# Altium schematic sheet STM32F103xx_LQFP48.SchDoc
size A; SheetNumber: 1; SheetTotal: 9
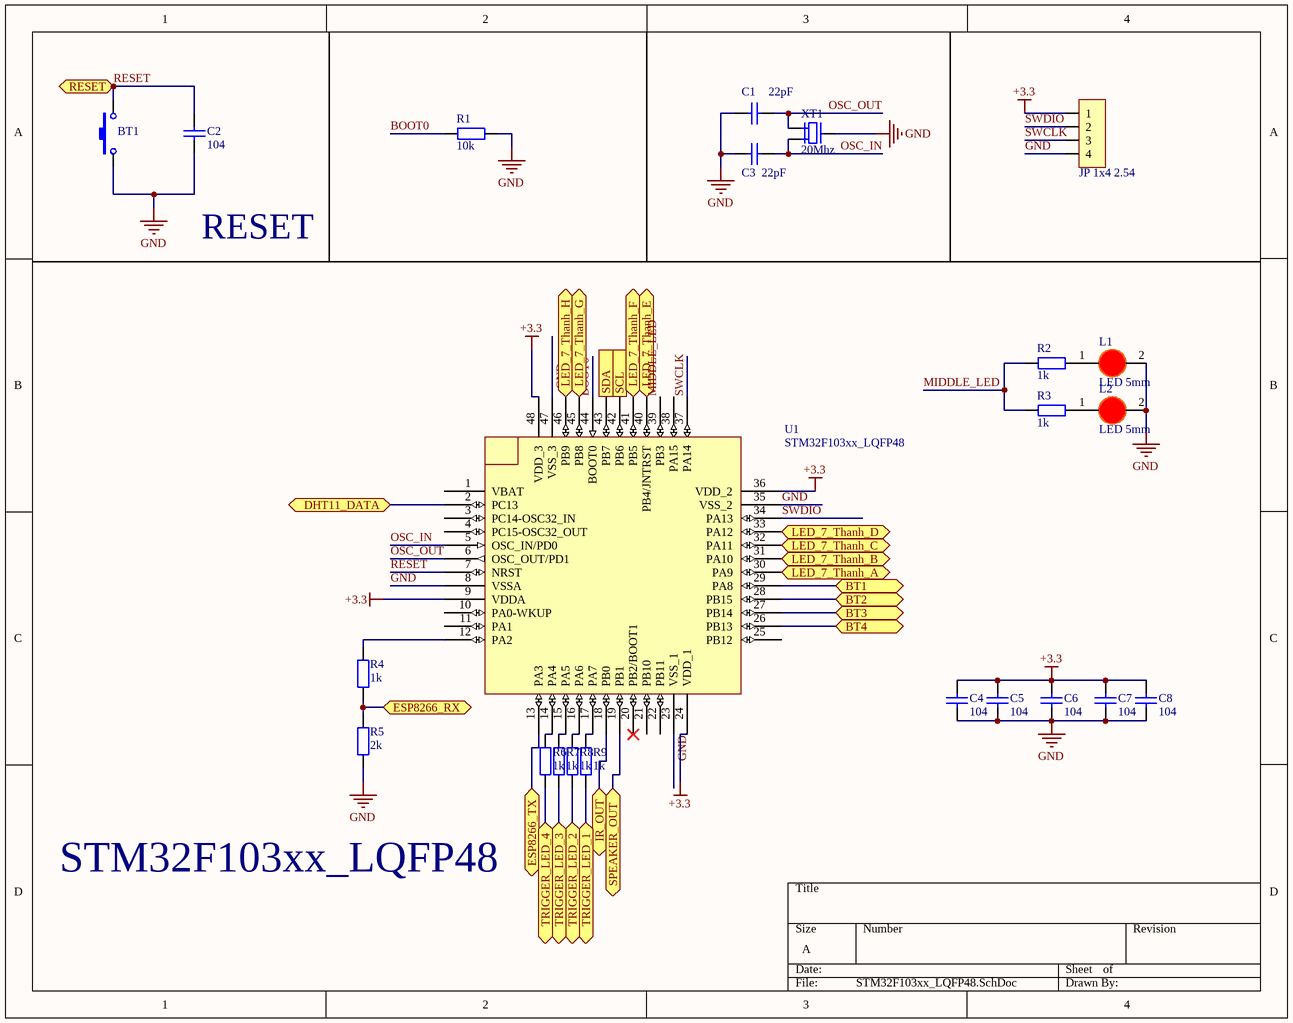
[diagram p0: STM32F103xx_LQFP48.SchDoc]

## Parts
BT1  Nut Nhan 2 Chan SMD 3x6x2.5  [Nut Nhan 2 Chan SMD 3x6x2.5]  (value not drawn)
C1  22pF  [tu 0603]
C2  104  [tu 0603]
C3  22pF  [tu 0603]
C4  104  [tu 0603]
C5  104  [tu 0603]
C6  104  [tu 0603]
C7  104  [tu 0603]
C8  104  [tu 0603]
JP1  JP 1x4 2.54  [JP 1x4 DC]
L1  LED 5mm  [LED-5MM-RED]
L2  LED 5mm  [LED-5MM-RED]
R1  10k  [tro smd 0603]
R2  1k  [tro smd 0603]
R3  1k  [tro smd 0603]
R4  1k  [tro smd 0603]
R5  2k  [tro smd 0603]
R6  1k  [tro smd 0603]
R7  1k  [tro smd 0603]
R8  1k  [tro smd 0603]
R9  1k  [tro smd 0603]
U1  STM32F103xx_LQFP48  [STM32_LQPF48]
XT1  20Mhz  [Thach Anh 3 Chan SMD]

## Ports
BT1 (bidir), BT2 (bidir), BT3 (bidir), BT4 (bidir), DHT11_DATA (bidir), ESP8266_RX (bidir), ESP8266_TX (bidir), IR_OUT (bidir), LED_7_Thanh_A (bidir), LED_7_Thanh_B (bidir), LED_7_Thanh_C (bidir), LED_7_Thanh_D (bidir), LED_7_Thanh_E (bidir), LED_7_Thanh_F (bidir), LED_7_Thanh_G (bidir), LED_7_Thanh_H (bidir), RESET (bidir), SCL, SDA, SPEAKER_OUT (bidir), TRIGGER_LED_1 (bidir), TRIGGER_LED_2 (bidir), TRIGGER_LED_3 (bidir), TRIGGER_LED_4 (bidir)

## Nets
+3.3: C4.1 C5.1 C6.1 C7.1 C8.1 JP1.1 U1.9(VDDA) U1.24(VDD_1) U1.36(VDD_2) U1.48(VDD_3)
GND: BT1.1 C1.2 C2.2 C3.2 C4.2 C5.2 C6.2 C7.2 C8.2 JP1.4 L1.2(K) L2.2(K) R1.2 R5.1 U1.8(VSSA) U1.23(VSS_1) U1.35(VSS_2) U1.47(VSS_3) XT1.2
BOOT0: R1.1 U1.44(BOOT0)
BT1: U1.29(PA8) ; port BT1
BT2: U1.28(PB15) ; port BT2
BT3: U1.27(PB14) ; port BT3
BT4: U1.26(PB13) ; port BT4
DHT11_DATA: U1.2(PC13) ; port DHT11_DATA
ESP8266_RX: R4.1 R5.2 ; port ESP8266_RX
ESP8266_TX: U1.13(PA3) ; port ESP8266_TX
IR_OUT: U1.18(PB0) ; port IR_OUT
LED_7_Thanh_A: U1.30(PA9) ; port LED_7_Thanh_A
LED_7_Thanh_B: U1.31(PA10) ; port LED_7_Thanh_B
LED_7_Thanh_C: U1.32(PA11) ; port LED_7_Thanh_C
LED_7_Thanh_D: U1.33(PA12) ; port LED_7_Thanh_D
LED_7_Thanh_E: U1.40(PB4/JNTRST) ; port LED_7_Thanh_E
LED_7_Thanh_F: U1.41(PB5) ; port LED_7_Thanh_F
LED_7_Thanh_G: U1.45(PB8) ; port LED_7_Thanh_G
LED_7_Thanh_H: U1.46(PB9) ; port LED_7_Thanh_H
MIDDLE_LED: R2.1 R3.1 U1.39(PB3)
OSC_IN: C3.1 U1.5(OSC_IN/PD0) XT1.3
OSC_OUT: C1.1 U1.6(OSC_OUT/PD1) XT1.1
RESET: BT1.2 C2.1 U1.7(NRST) ; port RESET
SCL: U1.42(PB6) ; port SCL
SDA: U1.43(PB7) ; port SDA
SPEAKER_OUT: U1.19(PB1) ; port SPEAKER_OUT
SWCLK: JP1.3 U1.37(PA14)
SWDIO: JP1.2 U1.34(PA13)
TRIGGER_LED_1: R9.2 ; port TRIGGER_LED_1
TRIGGER_LED_2: R8.2 ; port TRIGGER_LED_2
TRIGGER_LED_3: R7.2 ; port TRIGGER_LED_3
TRIGGER_LED_4: R6.2 ; port TRIGGER_LED_4
NetL1_1: L1.1(A) R2.2
NetL2_1: L2.1(A) R3.2
NetR4_2: R4.2 U1.12(PA2)
NetR6_1: R6.1 U1.14(PA4)
NetR7_1: R7.1 U1.15(PA5)
NetR8_1: R8.1 U1.16(PA6)
NetR9_1: R9.1 U1.17(PA7)

Not connected (* = marked no-connect by the designer): U1 1(VBAT) 3(PC14-OSC32_IN) 4(PC15-OSC32_OUT) 10(PA0-WKUP) 11(PA1) 20(PB2/BOOT1)* 21(PB10) 22(PB11) 25(PB12) 38(PA15)

## Notes on the sheet
- RESET
- STM32F103xx_LQFP48

## Library data of the parts
BT1 = Nut Nhan 2 Chan SMD 3x6x2.5: Ma_Hang: MH001036; Ten: Nút Nhấn 2 Chân 3x6x2.5MM SMD
C1 C3 = Tu 0603 22pF 50V 10%: Dán; Don_Vi: Con; So_Chan: 2; Ten_Linh_Kien: Tụ 0603 22pF 50V 10%; Ma_Hang: MH004570; Chung_Loai: Dán; Kieu_Chan: *
C2 C4-C8 = Tu 0603 104 50V 10%: Dán; Don_Vi: Con; So_Chan: 2; Ten_Linh_Kien: Tụ 0603 104-100nF 10% 50V; Ma_Hang: MH004568; Chung_Loai: Dán; Kieu_Chan: *
JP1 = JP 1x4 2.54 Duc Cong: Cắm; Ten_Linh_Kien: Jump Đơn Đực 2.54MM 1x40P Cong Đứng; Don_Vi: Con; Ma_Hang: MH000904; Ghi_Chu: *; Kieu_Chan: *; Chung_Loai: Cắm
L1 L2 = LED 5mm Do: Cắm; Don_Vi: Con; Ma_Hang: MH008967; Ten_Linh_Kien: Led 5MM Phủ Đỏ (1000c); Ghi_Chu: *; Kieu_Chan: *; Chung_Loai: Cắm
R1 = Tro 0603 1% 10k: Dán; Don_Vi: Con; So_Chan: 2; Ten_Linh_Kien: Trở 0603 1% 10k; Ma_Hang: MH006333; Chung_Loai: Dán; Kieu_Chan: *
R2-R4 R6-R9 = Tro 0603 1% 1k: Dán; So_Chan: 2; Don_Vi: Con; Ten_Linh_Kien: Trở 0603 1% 1k; Ma_Hang: MH006334; Chung_Loai: Dán; Kieu_Chan: *
R5 = Tro 0603 5% 2k: Dán; Don_Vi: Con; So_Chan: 2; Ten_Linh_Kien: Trở 0603 5% 2k; Ma_Hang: MH006324; Chung_Loai: Dán; Kieu_Chan: *
XT1 = Thach anh 3 Chan SMD: Crystal For all Crystal 2pin.; Value: 4Mhz
U1 = STM32F103xx_LQFP48: Published: 30-May-2008; DatasheetVersion: rev6, Mar-2008; PackageVersion: Mar-2008; PackageReference: LQFP48; Publisher: Altium Limited; PackageDescription: 48-Pin Low-Profile Quad Flat Pack, 7 x 7 mm Body, 0.5 mm Pitch (LQFP48); ComponentLink1Description: Manufacturer Link; ComponentLink1URL: www.st.com/stm32; ComponentLink2Description: Datasheet; ComponentLink2URL: http://www.st.com/stonline/products/literature/ds/13587.pdf